# Altium schematic sheet SHDN-IMD-S01-V00-IMDDaughter.SchDoc: IMD BOARD
size A3; Date: 10/07/2020; DrawnBy: Alikhan Hassan; DocumentNumber: 1; Revision: 00; SheetNumber: 1; SheetTotal: 6; Project: IMD Daughter board 2020; Version: 01; Application_BuildNumber: 00
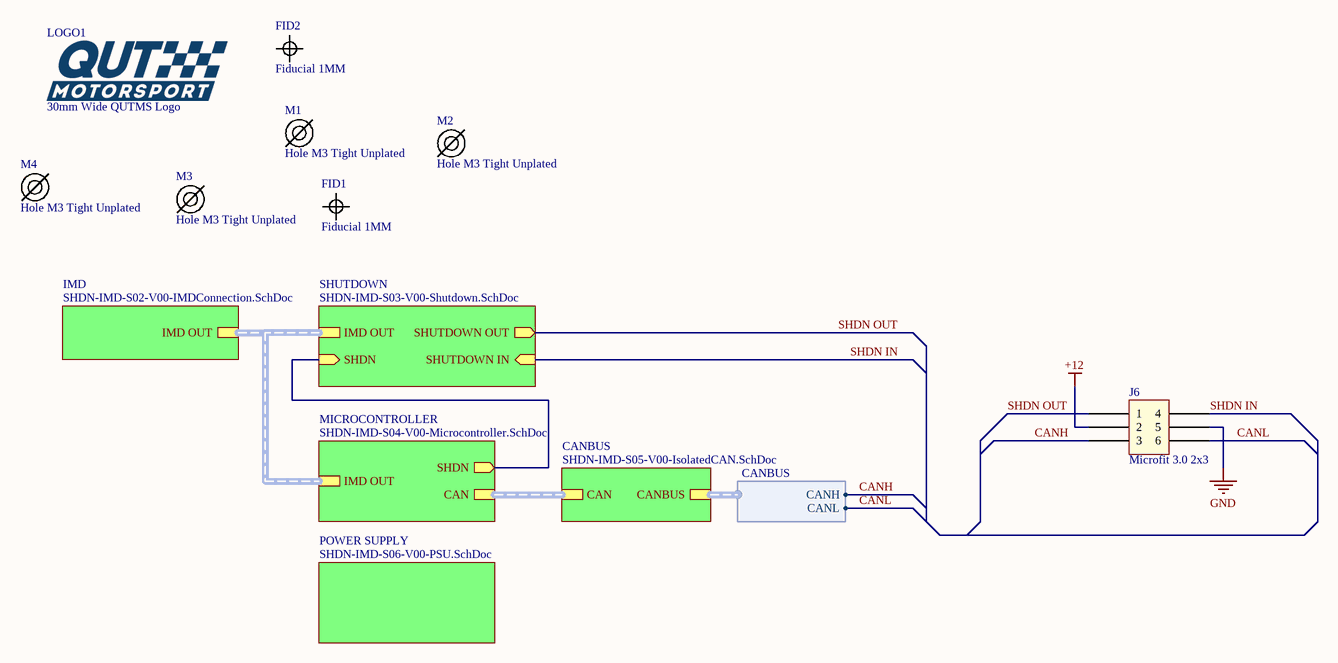
[diagram p0: SHDN-IMD-S01-V00-IMDDaughter.SchDoc]

## Parts
FID1  Fiducial 1MM  [FIDUCIAL 1MM]
FID2  Fiducial 1MM  [FIDUCIAL 1MM]
J6  Microfit 3.0 2x3  [Microfit_2X3_R_TH]
LOGO1  30mm Wide QUTMS Logo  [QUTMS LOGO 30MM]
M1  Hole M3 Tight Unplated  [M3.2 UNPLATED]
M2  Hole M3 Tight Unplated  [M3.2 UNPLATED]
M3  Hole M3 Tight Unplated  [M3.2 UNPLATED]
M4  Hole M3 Tight Unplated  [M3.2 UNPLATED]

## Sub-sheets
CANBUS = SHDN-IMD-S05-V00-IsolatedCAN.SchDoc: CANBUS (harness CANBUS), CAN (harness CAN)
IMD = SHDN-IMD-S02-V00-IMDConnection.SchDoc: IMD OUT (harness IMD OUT)
MICROCONTROLLER = SHDN-IMD-S04-V00-Microcontroller.SchDoc: IMD OUT (harness IMD OUT), SHDN (out), CAN (harness CAN)
POWER SUPPLY = SHDN-IMD-S06-V00-PSU.SchDoc: no entries
SHUTDOWN = SHDN-IMD-S03-V00-Shutdown.SchDoc: SHUTDOWN IN (in), SHUTDOWN OUT (out), IMD OUT (harness IMD OUT), SHDN (in)

## Harnesses
CANBUS: CANH, CANL

## Nets
+12: J6.2
GND: J6.5
CANH: J6.3 ; sheet CANBUS/CANBUS.CANH
CANL: J6.6 ; sheet CANBUS/CANBUS.CANL
SHDN IN: J6.4 ; sheet SHUTDOWN/SHUTDOWN IN
SHDN OUT: J6.1 ; sheet SHUTDOWN/SHUTDOWN OUT
(unnamed): sheet SHUTDOWN/SHDN, sheet MICROCONTROLLER/SHDN

## Buses and harness runs
harness sheet CANBUS/CAN = sheet MICROCONTROLLER/CAN
harness sheet IMD/IMD OUT = sheet MICROCONTROLLER/IMD OUT = sheet SHUTDOWN/IMD OUT

## Notes on the sheet
- Revision History:
- Sheet Title:
- Rev
- Date
- Description
- Project:
- Size:
- Drawn By:
- A3
- Number:
- Revision:
- Sheet
- Version:
- of
- QUT Motorsport
- O-120, Gardens Point
- 2 George Street
- Brisbane, QLD 4000
- Australia
- Print Date:
- Print Time:
- File Name:

## Library data of the parts
J6 = Microfit_2x3
LOGO1 = QUTMS Logo 30mm
M1-M4 = Hole M3 Tight Unplated: M3.2 Hole, No Plating